# Altium schematic sheet Microcontroller.SchDoc
size A2
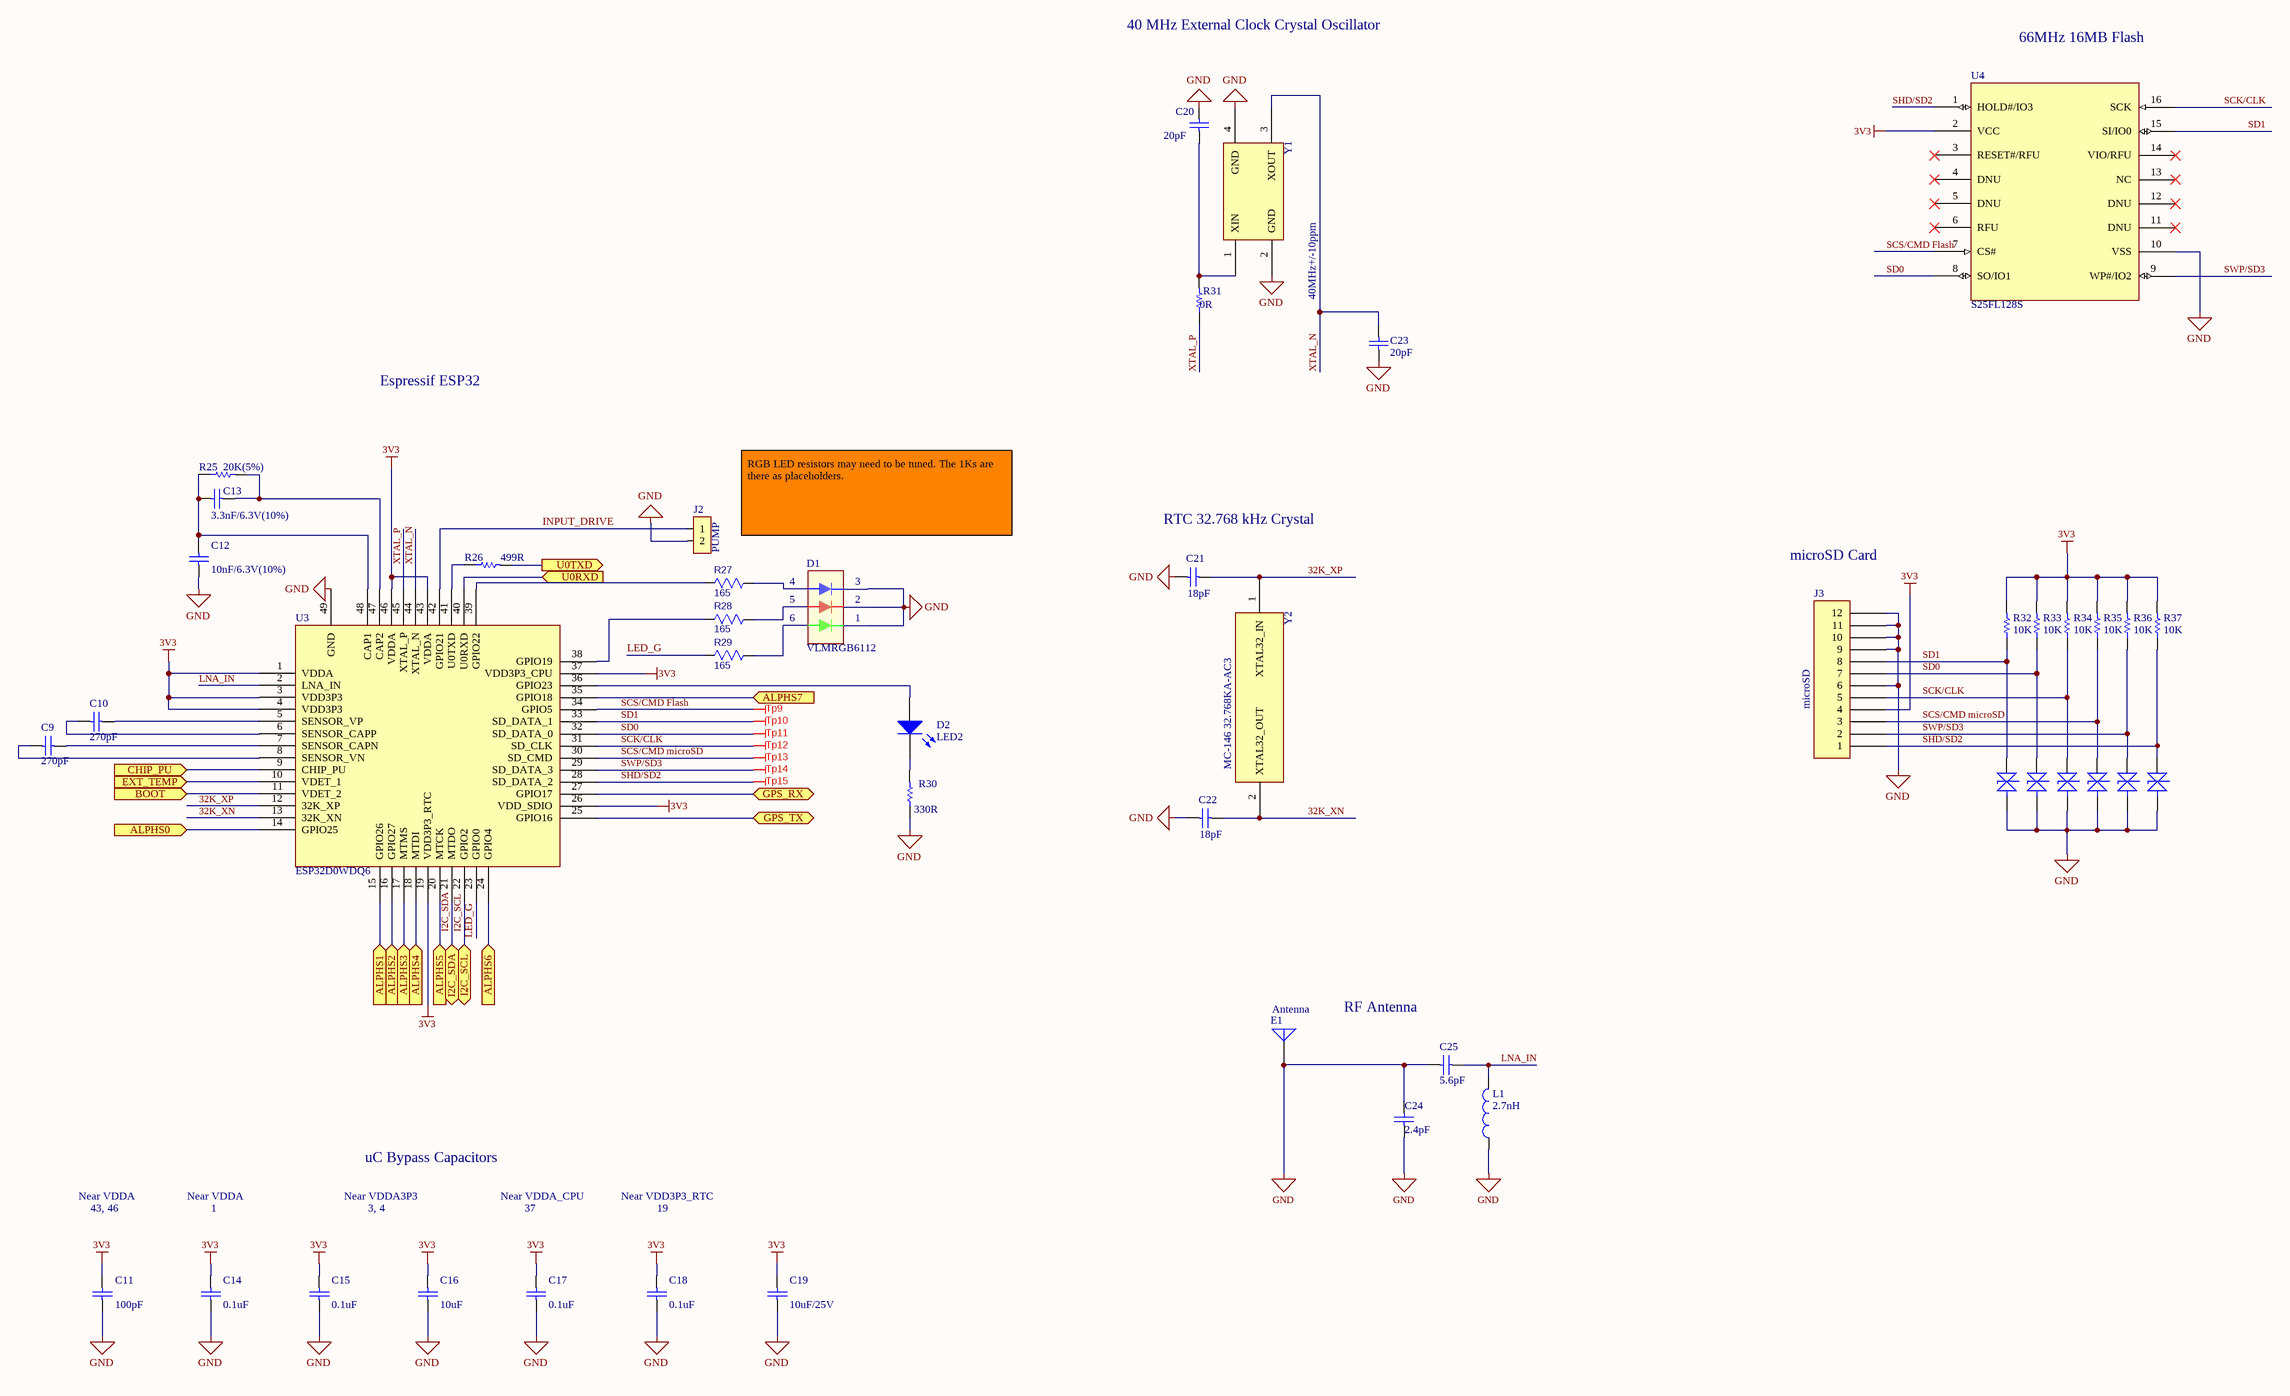
[diagram p0: Microcontroller.SchDoc]

## Parts
C9  value 270pF  [1608[0603]]  (hidden comment: Cap)
C10  value 270pF  [1608[0603]]  (hidden comment: Cap)
C11  value 100pF  [1608[0603]]  (hidden comment: Cap)
C12  value 10nF/6.3V(10%)  [1608[0603]]  (hidden comment: Cap)
C13  value 3.3nF/6.3V(10%)  [1608[0603]]  (hidden comment: Cap)
C14  value 0.1uF  [1608[0603]]  (hidden comment: Cap)
C15  value 0.1uF  [1608[0603]]  (hidden comment: Cap)
C16  value 10uF  [1608[0603]]  (hidden comment: Cap)
C17  value 0.1uF  [1608[0603]]  (hidden comment: Cap)
C18  value 0.1uF  [1608[0603]]  (hidden comment: Cap)
C19  value 10uF/25V  [1608[0603]]  (hidden comment: Cap)
C20  value 20pF  [1608[0603]]  (hidden comment: Cap)
C21  value 18pF  [1608[0603]]  (hidden comment: Cap)
C22  value 18pF  [1608[0603]]  (hidden comment: Cap)
C23  value 20pF  [1608[0603]]  (hidden comment: Cap)
C24  value 2.4pF  [1608[0603]]  (hidden comment: Cap)
C25  value 5.6pF  [1608[0603]]  (hidden comment: Cap)
D1  VLMRGB6112  [VLMRGB6112]
D2  LED2  [3.2X1.6X1.1]
D3  ESD7951ST5GOSCT-ND  [SODFL100X40-2N]  (value not drawn)
D4  ESD7951ST5GOSCT-ND  [SODFL100X40-2N]  (value not drawn)
D5  ESD7951ST5GOSCT-ND  [SODFL100X40-2N]  (value not drawn)
D6  ESD7951ST5GOSCT-ND  [SODFL100X40-2N]  (value not drawn)
D7  ESD7951ST5GOSCT-ND  [SODFL100X40-2N]  (value not drawn)
D8  ESD7951ST5GOSCT-ND  [SODFL100X40-2N]  (value not drawn)
E1  Antenna  [SWRA1117]
J2  PUMP  [6410/2pin]
J3  microSD  [SD-47219-001]
L1  value 2.7nH  [INDC1608L]  (hidden comment: Inductor)
R25  value 20K(5%)  [6-0805_N]  (hidden comment: Res1)
R26  value 499R  [6-0805_L]  (hidden comment: Res1)
R27  165  [R1608[0603] small]
R28  165  [R1608[0603] small]
R29  165  [R1608[0603] small]
R30  value 330R  [6-0805_N]  (hidden comment: Res1)
R31  value 0R  [6-0805_N]  (hidden comment: Res1)
R32  value 10K  [6-0805_N]  (hidden comment: Res1)
R33  value 10K  [6-0805_N]  (hidden comment: Res1)
R34  value 10K  [6-0805_N]  (hidden comment: Res1)
R35  value 10K  [6-0805_N]  (hidden comment: Res1)
R36  value 10K  [6-0805_N]  (hidden comment: Res1)
R37  value 10K  [6-0805_N]  (hidden comment: Res1)
Tp9  PAD  [TP_SMD_45MIL]  (value not drawn)  (no BOM)
Tp10  PAD  [TP_SMD_45MIL]  (value not drawn)  (no BOM)
Tp11  PAD  [TP_SMD_45MIL]  (value not drawn)  (no BOM)
Tp12  PAD  [TP_SMD_45MIL]  (value not drawn)  (no BOM)
Tp13  PAD  [TP_SMD_45MIL]  (value not drawn)  (no BOM)
Tp14  PAD  [TP_SMD_45MIL]  (value not drawn)  (no BOM)
Tp15  PAD  [TP_SMD_45MIL]  (value not drawn)  (no BOM)
U3  ESP32D0WDQ6  [QFN40P600X600X90_HS-49N]
U4  S25FL128S  [SOIC127P1030X265-16N]
Y1  FA-20H  [FA-20H]  (value not drawn)
Y2  MC-146 32.768KA-AC3  [MC-146]

## Ports
ALPHS0 (in), ALPHS1 (in), ALPHS2 (in), ALPHS3 (in), ALPHS4 (in), ALPHS5 (in), ALPHS6 (in), ALPHS7 (in), BOOT (in), CHIP_PU (in), EXT_TEMP (in), GPS_RX (bidir), GPS_TX (bidir), I2C_SCL (bidir), I2C_SDA (bidir), U0RXD (in), U0TXD (out)

## Nets
3V3: C11.2 C14.2 C15.2 C16.2 C17.2 C18.2 C19.2 J3.4 R32.2 R33.2 R34.2 R35.2 R36.2 R37.2 U3.1(VDDA) U3.3(VDD3P3) U3.4(VDD3P3) U3.19(VDD3P3_RTC) U3.26(VDD_SDIO) U3.37(VDD3P3_CPU) U3.43(VDDA) U3.46(VDDA) U4.2(VCC)
GND: C11.1 C12.1 C14.1 C15.1 C16.1 C17.1 C18.1 C19.1 C20.2 C21.1 C22.1 C23.2 C24.1 C24.2 C25.2 D1.1(A2) D1.2(C3) D1.3(A3) D3.1(CATHODE) D4.1(CATHODE) D5.1(CATHODE) D6.1(CATHODE) D7.1(CATHODE) D8.1(CATHODE) E1.1(A) J2.2 J3.6 J3.9 J3.10 J3.11 J3.12 L1.1 R30.1 U3.49(GND) U4.10(VSS) Y1.2(GND) Y1.4(GND)
32K_XN: C22.2 U3.13(32K_XN) Y2.2(XTAL32_OUT)
32K_XP: C21.2 U3.12(32K_XP) Y2.1(XTAL32_IN)
ALPHS0: U3.14(GPIO25) ; port ALPHS0
ALPHS1: U3.15(GPIO26) ; port ALPHS1
ALPHS2: U3.16(GPIO27) ; port ALPHS2
ALPHS3: U3.17(MTMS) ; port ALPHS3
ALPHS4: U3.18(MTDI) ; port ALPHS4
ALPHS5: U3.20(MTCK) ; port ALPHS5
ALPHS6: U3.24(GPIO4) ; port ALPHS6
ALPHS7: U3.35(GPIO18) ; port ALPHS7
BOOT: U3.11(VDET_2) ; port BOOT
CHIP_PU: U3.9(CHIP_PU) ; port CHIP_PU
EXT_TEMP: U3.10(VDET_1) ; port EXT_TEMP
GPS_RX: U3.27(GPIO17) ; port GPS_RX
GPS_TX: U3.25(GPIO16) ; port GPS_TX
I2C_SCL: U3.22(GPIO2) ; port I2C_SCL
I2C_SDA: U3.21(MTDO) ; port I2C_SDA
INPUT_DRIVE: J2.1 U3.42(GPIO21)
LED_G: R29.1 U3.23(GPIO0)
LNA_IN: C25.1 L1.2 U3.2(LNA_IN)
SCK/CLK: D5.2(ANODE) J3.5 R34.1 Tp12.1 U3.31(SD_CLK) U4.16(SCK)
SCS/CMD Flash: Tp9.1 U3.34(GPIO5) U4.7(CS#)
SCS/CMD microSD: D6.2(ANODE) J3.3 R35.1 Tp13.1 U3.30(SD_CMD)
SD0: D4.2(ANODE) J3.7 R33.1 Tp11.1 U3.32(SD_DATA_0) U4.8(SO/IO1)
SD1: D3.2(ANODE) J3.8 R32.1 Tp10.1 U3.33(SD_DATA_1) U4.15(SI/IO0)
SHD/SD2: D8.2(ANODE) J3.1 R37.1 Tp15.1 U3.28(SD_DATA_2) U4.1(HOLD#/IO3)
SWP/SD3: D7.2(ANODE) J3.2 R36.1 Tp14.1 U3.29(SD_DATA_3) U4.9(WP#/IO2)
U0RXD: U3.40(U0RXD) ; port U0RXD
U0TXD: R26.2 ; port U0TXD
XTAL_N: C23.1 U3.44(XTAL_N) Y1.3(XOUT)
XTAL_P: R31.1 U3.45(XTAL_P)
NetC9_1: C9.1 U3.8(SENSOR_VN)
NetC9_2: C9.2 U3.7(SENSOR_CAPN)
NetC10_1: C10.1 U3.5(SENSOR_VP)
NetC10_2: C10.2 U3.6(SENSOR_CAPP)
NetC12_2: C12.2 C13.2 R25.1 U3.48(CAP1)
NetC13_1: C13.1 R25.2 U3.47(CAP2)
NetC20_1: C20.1 R31.2 Y1.1(XIN)
NetD1_4: D1.4(C1) R27.2
NetD1_5: D1.5(C1) R28.2
NetD1_6: D1.6(C1) R29.2
NetD2_1: D2.1(A) U3.36(GPIO23)
NetD2_2: D2.2(K) R30.2
NetR26_1: R26.1 U3.41(U0TXD)
NetR27_1: R27.1 U3.39(GPIO22)
NetR28_1: R28.1 U3.38(GPIO19)

Not connected (* = marked no-connect by the designer): U4 3(RESET#/RFU)* 4(DNU)* 5(DNU)* 6(RFU)* 11(DNU)* 12(DNU)* 13(NC)* 14(VIO/RFU)*

## Notes on the sheet
- 40 MHz External Clock Crystal Oscillator
- 66MHz 16MB Flash
- (near Y1) 40MHz+/-10ppm
- Espressif ESP32
- RGB LED resistors may need to be tuned. The 1Ks are there as placeholders.
- RTC 32.768 kHz Crystal
- microSD Card
- RF Antenna
- uC Bypass Capacitors
- Near VDDA
- 43, 46
- 1
- Near VDDA3P3
- 3, 4
- Near VDDA_CPU
- 37
- Near VDD3P3_RTC
- 19

## Library data of the parts
C9-C25 = Cap: Capacitor; Published: 8-Jun-2000; LatestRevisionDate: 17-Jul-2002; LatestRevisionNote: Re-released for DXP Platform.; PackageReference: RAD-0.3; Publisher: Altium Limited; PackageDescription: Radial Cap, Thru-Hole; 2 Leads; 0.3 in Pin Spacing
  C24: Supplier Link: 490-11257-1-ND
  C25: Supplier Link: 490-7162-1-ND
D1 = VLMRGB6112: LED RGB Clear 624nm/526nm/469nm 2V/3.1V/3V PLCC-6; Manufacturer: Vishay Semiconductor Opto Division; Manufacturer Part Number: VLMRGB6112-00-GS08; TZOA PN: 250-00002; Supplier 1: Digi-Key; Supplier Part Number 1: VLMRGB6112-00-GS08CT-ND
D2 = LED2: Typical RED, GREEN, YELLOW, AMBER GaAs LED; Published: 8-Jun-2000; LatestRevisionDate: 17-Jul-2002; LatestRevisionNote: Re-released for DXP Platform.; PackageVersion: Feb-2002; PackageReference: 3.2X1.6X1.1; Publisher: Altium Limited; PackageDescription: SM LED; 2 Flat Leads
D3-D8 = ESD7951S: TVS Diode; Supplier Link: ESD7951ST5GOSCT-ND
E1 = Antenna: Generic Antenna; Published: 24-Mar-1999; LatestRevisionDate: 17-Jul-2002; LatestRevisionNote: Re-released for DXP Platform.; PackageReference: PIN1; Publisher: Altium Limited
J2 = CON2: Connector 2 pin; Value: *; Type: *; Mfg.: *; Supplier: *; Part#: *; Price: *; Notes: *
J3 = CON12: Manufacturer: *; Manufacturer Part Number: *
L1 = Inductor: Code_IEC: 1005; Published: 8-Jun-2000; LatestRevisionDate: 29-May-2009; LatestRevisionNote: IPC-7351 Footprint Added.; PackageReference: 0402-A; Publisher: Altium Limited; PackageDescription: Chip Inductor; Code_JEITA: 0402; Supplier Link: 490-1103-1-ND
R25 R26 R30-R37 = Res1: Resistor; Published: 8-Jun-2000; LatestRevisionDate: 17-Jul-2002; LatestRevisionNote: Re-released for DXP Platform.; PackageReference: AXIAL-0.3; Publisher: Altium Limited; PackageDescription: Axial Device, Thru-Hole; 2 Leads; 0.3 in Pin Spacing
R27-R29 = 1K00_0603_0.1W: RES 1K Ohm ±5%, 0.25W,1/4W 0603; Manufacturer: Rohm; Manufacturer Part Number: ESR03EZPJ102; TZOA PN: 209-00007; Product Training Modules: Resistor Products Overview; Featured Product: ROHM Chip Resistors; EDA / CAD Models: Download from Accelerated Designs; Temperature Coefficient: ±200ppm/°C; Online Catalog: ESR03 Series; Other Names: RHM1.0KDDKR; Supplier 1: Digi-Key; Stock 1: 63701; Pricing 1: 1=0.11, 10=0.098, 100=0.0378, 1000=0.0166, 2500=0.0144 (USD); Standard Package: 1; Category: Resistors; Family: Chip Resistor - Surface Mount; Series: ESR; Packaging: Cut Tape (CT); Resistance (Ohms): 1k; Tolerance: ±5%; Power (Watts): 0.25W, 1/4W; Composition: Thick Film; Features: Automotive AEC-Q200, Pulse Withstanding; Operating Temperature: -55°C ~ 155°C; Package / Case: 0603 (1608 Metric); Supplier Device Package: 0603 (1608 Metric); Size / Dimension: 0.063" L x 0.031" W (1.60mm x 0.80mm); Height: 0.022" (0.55mm); Number of Terminations: 2; ComponentLink1URL: https://datasheet.ciiva.com/2469/esr-2469603.pdf; ComponentLink1Description: https://datasheet.ciiva.com/2469/esr-2469603.pdf; ComponentLink2URL: https://datasheet.ciiva.com/2469/esr-2469604.pdf; ComponentLink2Description: https://datasheet.ciiva.com/2469/esr-2469604.pdf; ComponentLink3URL: https://datasheet.ciiva.com/2469/esr-2469605.pdf; ComponentLink3Description: https://datasheet.ciiva.com/2469/esr-2469605.pdf; Supplier Part Number 1: 311-165HRCT-ND
Tp9-Tp15 = TP_SMD_45MIL: SMD Test Pad; Manufacturer: No P/N Required; P/N: No P/N; UM: EA; Fast Supplier: No P/N Required; Fast Supplier P/N: No P/N Required; Manufacturer P/N: No P/N Required
U3 = ESP32: Microcontroller; Manufacturer: *; Manufacturer Part Number: *
U4 = S25FL128S: QSPI 128M Flash Memory; Manufacturer: *; Manufacturer Part Number: *
Y1 = Y1: 40MHz Crystal Oscillator; Supplier Link: SER4045CT-ND; Manufacturer: *; Manufacturer Part Number: *
Y2 = MC-146 32.768KA-AC3: 32.768 kHz Crystal; Manufacturer: *; Manufacturer Part Number: *